# EAGLE schematic untitled (EAGLE 7.2.0)
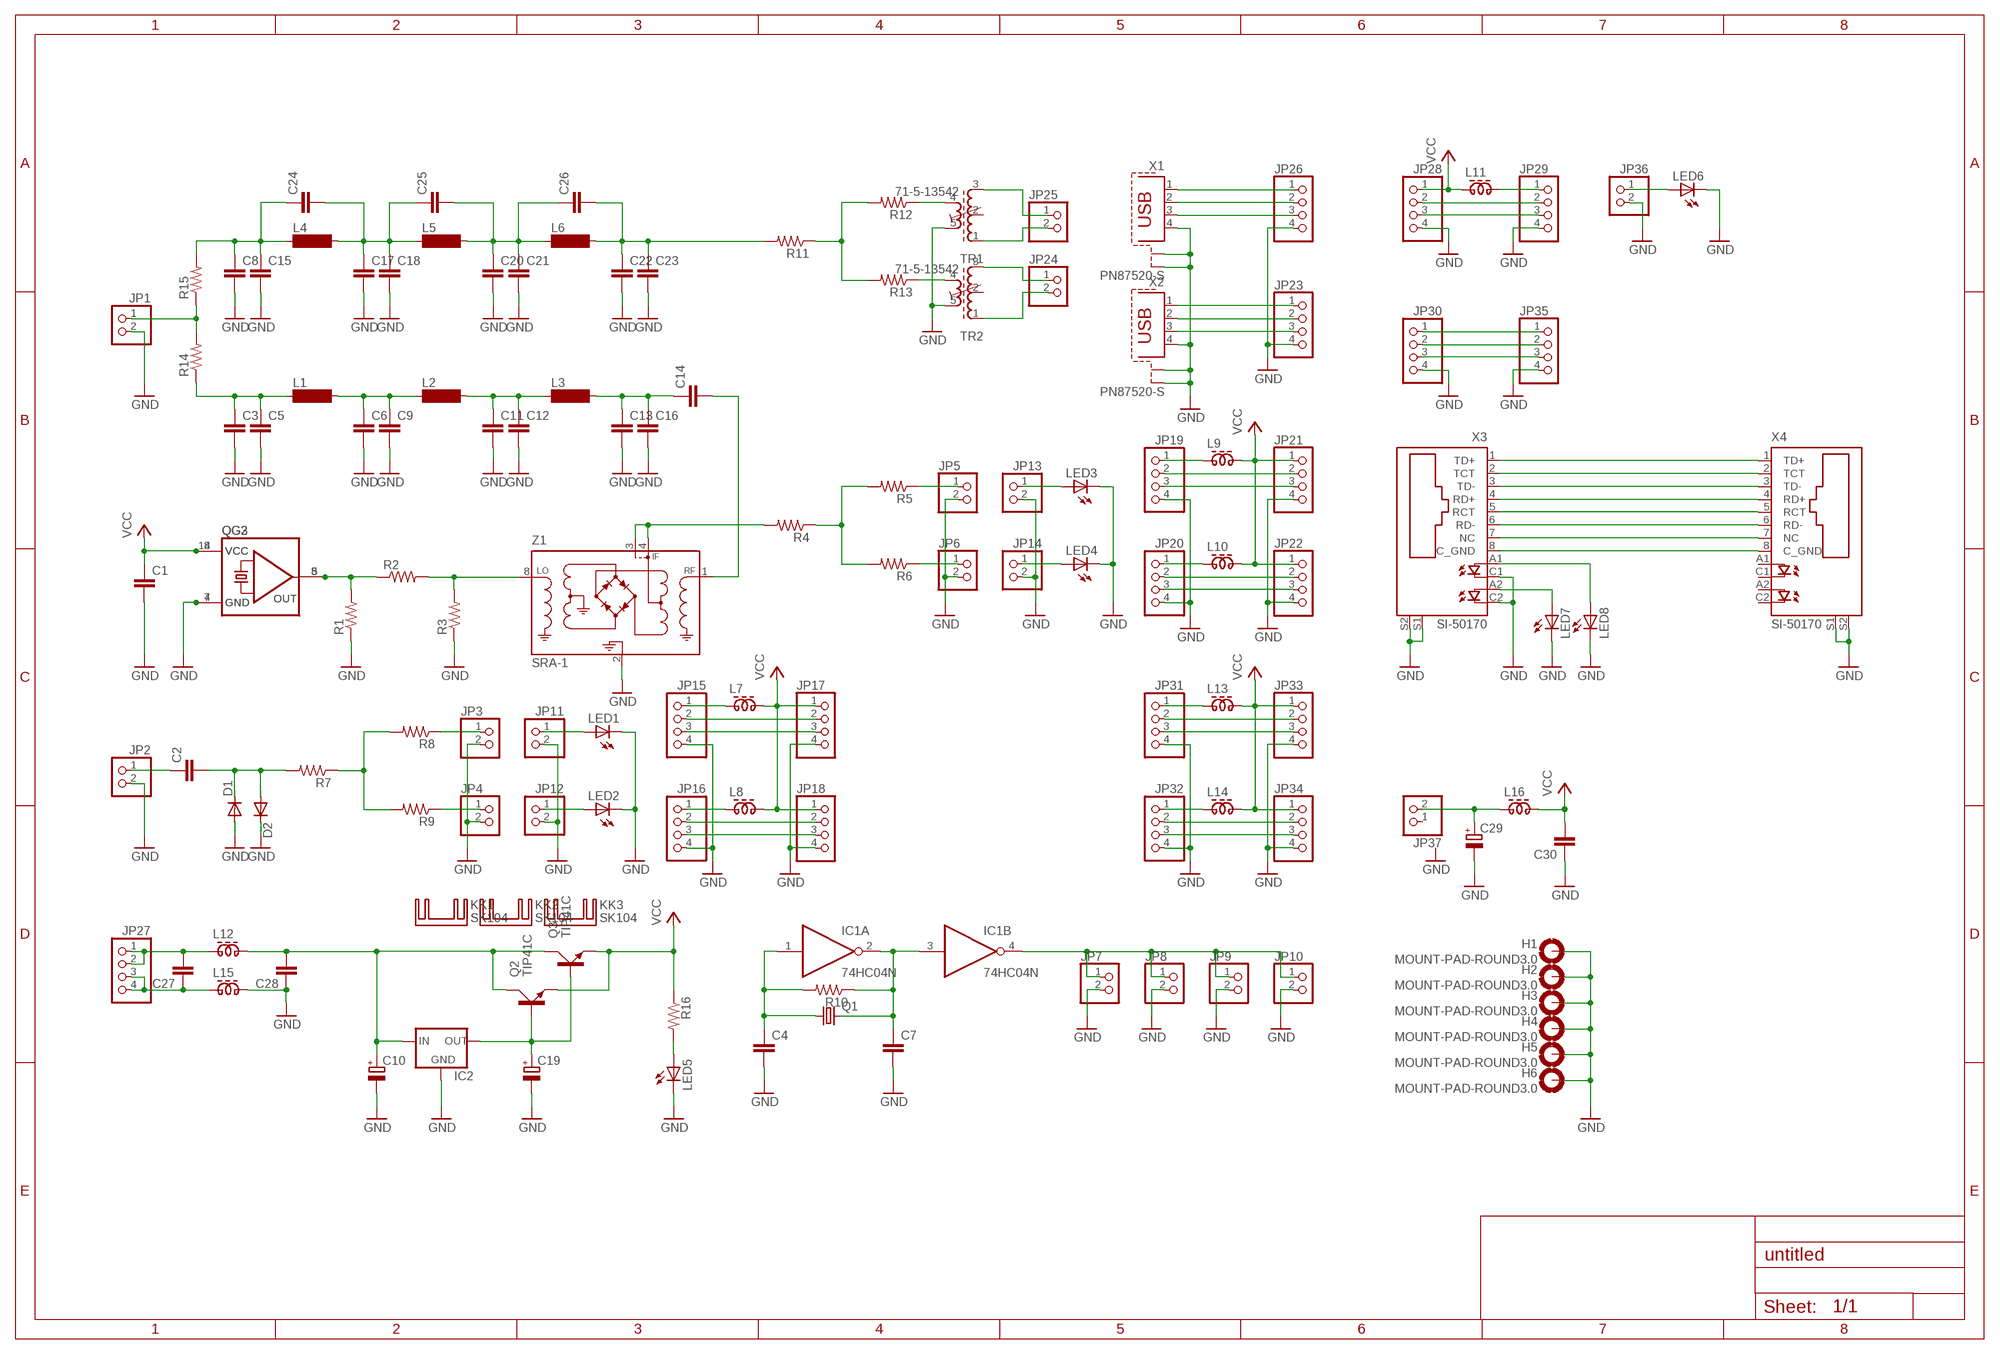
[diagram p0: schematic, sheet 1]

## Parts
C1  C-EUC1206  [C1206]
C2  C-EUC1206  [C1206]
C3  C-EUC1206  [C1206]
C4  C-EUC1206  [C1206]
C5  C-EUC1206  [C1206]
C6  C-EUC1206  [C1206]
C7  C-EUC1206  [C1206]
C8  C-EUC1206  [C1206]
C9  C-EUC1206  [C1206]
C10  CPOL-EUE2.5-7  [E2,5-7]
C11  C-EUC1206  [C1206]
C12  C-EUC1206  [C1206]
C13  C-EUC1206  [C1206]
C14  C-EUC1206  [C1206]
C15  C-EUC1206  [C1206]
C16  C-EUC1206  [C1206]
C17  C-EUC1206  [C1206]
C18  C-EUC1206  [C1206]
C19  CPOL-EUE2.5-7  [E2,5-7]
C20  C-EUC1206  [C1206]
C21  C-EUC1206  [C1206]
C22  C-EUC1206  [C1206]
C23  C-EUC1206  [C1206]
C24  C-EUC1206  [C1206]
C25  C-EUC1206  [C1206]
C26  C-EUC1206  [C1206]
C27  C-EUC1206  [C1206]
C28  C-EUC1206  [C1206]
C29  CPOL-EUE2.5-7  [E2,5-7]
C30  C-EUC1206  [C1206]
D1  DIODE-DO214AC  [DO214AC]
D2  DIODE-DO214AC  [DO214AC]
H1  MOUNT-PAD-ROUND3.0  [3,0-PAD]
H2  MOUNT-PAD-ROUND3.0  [3,0-PAD]
H3  MOUNT-PAD-ROUND3.0  [3,0-PAD]
H4  MOUNT-PAD-ROUND3.0  [3,0-PAD]
H5  MOUNT-PAD-ROUND3.0  [3,0-PAD]
H6  MOUNT-PAD-ROUND3.0  [3,0-PAD]
IC1  74HC04N  [DIL14]
IC2  78XXS  [78XXS]
JP1  PINHD-1X2  [1X02]
JP2  PINHD-1X2  [1X02]
JP3  PINHD-1X2  [1X02]
JP4  PINHD-1X2  [1X02]
JP5  PINHD-1X2  [1X02]
JP6  PINHD-1X2  [1X02]
JP7  PINHD-1X2  [1X02]
JP8  PINHD-1X2  [1X02]
JP9  PINHD-1X2  [1X02]
JP10  PINHD-1X2  [1X02]
JP11  PINHD-1X2  [1X02]
JP12  PINHD-1X2  [1X02]
JP13  PINHD-1X2  [1X02]
JP14  PINHD-1X2  [1X02]
JP15  PINHD-1X4  [1X04]
JP16  PINHD-1X4  [1X04]
JP17  PINHD-1X4  [1X04]
JP18  PINHD-1X4  [1X04]
JP19  PINHD-1X4  [1X04]
JP20  PINHD-1X4  [1X04]
JP21  PINHD-1X4  [1X04]
JP22  PINHD-1X4  [1X04]
JP23  PINHD-1X4  [1X04]
JP24  PINHD-1X2  [1X02]
JP25  PINHD-1X2  [1X02]
JP26  PINHD-1X4  [1X04]
JP27  PINHD-1X4  [1X04]
JP28  PINHD-1X4  [1X04]
JP29  PINHD-1X4  [1X04]
JP30  PINHD-1X4  [1X04]
JP31  PINHD-1X4  [1X04]
JP32  PINHD-1X4  [1X04]
JP33  PINHD-1X4  [1X04]
JP34  PINHD-1X4  [1X04]
JP35  PINHD-1X4  [1X04]
JP36  PINHD-1X2  [1X02]
JP37  PINHD-1X2  [1X02]
KK1  SK104  [SK104]
KK2  SK104  [SK104]
KK3  SK104  [SK104]
L1  BS75  [BS75]
L2  BS75  [BS75]
L3  BS75  [BS75]
L4  BS75  [BS75]
L5  BS75  [BS75]
L6  BS75  [BS75]
L7  ZD60820512  [ZD6-2W5]
L8  ZD60820512  [ZD6-2W5]
L9  ZD60820512  [ZD6-2W5]
L10  ZD60820512  [ZD6-2W5]
L11  ZD60820512  [ZD6-2W5]
L12  ZD60820512  [ZD6-2W5]
L13  ZD60820512  [ZD6-2W5]
L14  ZD60820512  [ZD6-2W5]
L15  ZD60820512  [ZD6-2W5]
L16  ZD60820512  [ZD6-2W5]
LED1  LED3MM  [LED3MM]
LED2  LED3MM  [LED3MM]
LED3  LED3MM  [LED3MM]
LED4  LED3MM  [LED3MM]
LED5  LED3MM  [LED3MM]
LED6  LED3MM  [LED3MM]
LED7  LED3MM  [LED3MM]
LED8  LED3MM  [LED3MM]
Q1  CRYSTALHC49S  [HC49/S]
Q2  TIP41C  [TO220AV]
Q3  TIP41C  [TO220AV]
QG2  QG5460  [DIL08S]
QG3  QG5860  [DIL14S]
R1  R-US_M1206  [M1206]
R2  R-US_M1206  [M1206]
R3  R-US_M1206  [M1206]
R4  R-US_M1206  [M1206]
R5  R-US_M1206  [M1206]
R6  R-US_M1206  [M1206]
R7  R-US_M1206  [M1206]
R8  R-US_M1206  [M1206]
R9  R-US_M1206  [M1206]
R10  R-US_M1206  [M1206]
R11  R-US_M1206  [M1206]
R12  R-US_M1206  [M1206]
R13  R-US_M1206  [M1206]
R14  R-US_M1206  [M1206]
R15  R-US_M1206  [M1206]
R16  R-US_M1206  [M1206]
TR1  71-5-13542  [71-5]
TR2  71-5-13542  [71-5]
X1  PN87520-S  [PN87520-S]
X2  PN87520-S  [PN87520-S]
X3  SI-50170  [SI-50170]
X4  SI-50170  [SI-50170]
Z1  SRA-1  [A01]

## Nets
GND: C1.2 C3.2 C4.2 C5.2 C6.2 C7.2 C8.2 C9.2 C10.- C11.2 C12.2 C13.2 C15.2 C16.2 C17.2 C18.2 C19.- C20.2 C21.2 C22.2 C23.2 C28.1 C29.- C30.1 D1.A D2.C H1.B3,0(MOUNT) H2.B3,0(MOUNT) H3.B3,0(MOUNT) H4.B3,0(MOUNT) H5.B3,0(MOUNT) H6.B3,0(MOUNT) IC2.GND JP1.2 JP2.2 JP3.2 JP4.2 JP5.2 JP6.2 JP7.2 JP8.2 JP9.2 JP10.2 JP11.2 JP12.2 JP13.2 JP14.2 JP15.4 JP16.4 JP17.4 JP18.4 JP19.4 JP20.4 JP21.4 JP22.4 JP23.4 JP26.4 JP28.4 JP29.4 JP30.4 JP31.4 JP32.4 JP33.4 JP34.4 JP35.4 JP36.2 L15.2 LED1.K(C) LED2.K(C) LED3.K(C) LED4.K(C) LED5.K(C) LED6.K(C) LED7.K(C) LED8.K(C) QG2.4(GND) QG3.7(GND) R1.1 R3.1 TR1.5(A2) TR2.5(A2) X1.4 X1.S1 X1.S2 X2.4 X2.S1 X2.S2 X3.C1(C) X3.C2(C1) X3.S1 X3.S2 X4.S1 X4.S2 Z1.2(CASEGROUND)
N$1: C3.1 C5.1 L1.1 R14.1
N$2: C6.1 C9.1 L1.2 L2.1
N$3: JP1.1 R14.2 R15.1
N$4: C11.1 C12.1 L2.2 L3.1
N$5: C13.1 C14.1 C16.1 L3.2
N$6: QG2.5(OUT) QG3.8(OUT) R1.2 R2.1
N$7: R2.2 R3.2 Z1.8(L)
N$8: R4.2 Z1.3(IF) Z1.4(IF)
N$9: C14.2 Z1.1(R)
N$10: R4.1 R5.2 R6.2
N$11: C4.1 IC1.1(A:I) Q1.1 R10.2
N$12: C2.1 JP2.1
N$13: C2.2 D1.C D2.A R7.2
N$14: R7.1 R8.2 R9.2
N$15: JP3.1 R8.1
N$16: JP4.1 R9.1
N$17: JP5.1 R5.1
N$18: JP6.1 R6.1
N$19: C7.1 IC1.2(A:O) IC1.3(B:I) Q1.2 R10.1
N$20: IC1.4(B:O) JP7.1 JP8.1 JP9.1 JP10.1
N$21: JP11.1 LED1.A
N$22: JP12.1 LED2.A
N$23: JP13.1 LED3.A
N$24: JP14.1 LED4.A
N$25: JP15.2 JP17.2
N$26: JP15.3 JP17.3
N$27: JP16.2 JP18.2
N$28: JP16.3 JP18.3
N$29: JP15.1 L7.1
N$30: JP16.1 L8.1
N$31: JP19.2 JP21.2
N$32: JP19.3 JP21.3
N$33: C8.1 C15.1 C24.1 L4.1 R15.2
N$34: C17.1 C18.1 C24.2 C25.1 L4.2 L5.1
N$35: JP20.2 JP22.2
N$36: C20.1 C21.1 C25.2 C26.1 L5.2 L6.1
N$37: C22.1 C23.1 C26.2 L6.2 R11.2
N$38: R13.1 TR2.4(E2)
N$39: R11.1 R12.2 R13.2
N$40: R12.1 TR1.4(E2)
N$41: JP25.2 TR1.1(A1)
N$42: JP24.1 TR2.3(E1)
N$43: JP24.2 TR2.1(A1)
N$44: JP25.1 TR1.3(E1)
N$45: JP20.3 JP22.3
N$46: JP19.1 L9.1
N$47: JP20.1 L10.1
N$48: JP26.1 X1.1
N$49: JP26.2 X1.2
N$50: JP26.3 X1.3
N$51: JP23.1 X2.1
N$52: JP23.2 X2.2
N$53: JP23.3 X2.3
N$54: C10.+ C28.2 IC2.IN L12.2 Q2.C Q3.C
N$55: C19.+ IC2.OUT Q2.B Q3.B
N$56: JP28.2 JP29.2
N$57: JP28.3 JP29.3
N$58: LED5.A R16.2
N$59: JP30.2 JP35.2
N$60: JP31.2 JP33.2
N$61: JP31.3 JP33.3
N$62: JP32.2 JP34.2
N$63: JP32.3 JP34.3
N$64: JP31.1 L13.1
N$65: JP32.1 L14.1
N$66: JP29.1 L11.2
N$67: JP30.3 JP35.3
N$68: JP30.1 JP35.1
N$69: JP36.1 LED6.A
N$70: X3.1(TD+) X4.1(TD+)
N$71: X3.2(TCT) X4.2(TCT)
N$72: X3.3(TD-) X4.3(TD-)
N$73: X3.4(RD+) X4.4(RD+)
N$74: X3.5(RCT) X4.5(RCT)
N$75: X3.6(RD-) X4.6(RD-)
N$76: X3.7(NC) X4.7(NC)
N$77: X3.8(C_GND) X4.8(C_GND)
N$78: LED7.A X3.A2(A1)
N$79: LED8.A X3.A1(A)
N$80: C27.2 JP27.1 JP27.2 L12.1
N$81: C27.1 JP27.3 JP27.4 L15.1
N$84: C29.+ JP37.2 L16.1
VCC: C1.1 C30.2 JP17.1 JP18.1 JP21.1 JP22.1 JP28.1 JP33.1 JP34.1 L7.2 L8.2 L9.2 L10.2 L11.1 L13.2 L14.2 L16.2 Q2.E Q3.E QG2.8(VCC) QG3.14(VCC) R16.1
Unconnected: IC1.5(C:I) IC1.6(C:O) IC1.8(D:O) IC1.9(D:I) IC1.10(E:O) IC1.11(E:I) IC1.12(F:O) IC1.13(F:I) JP37.1 TR1.2(Z) TR1.S1 TR1.S2 TR2.2(Z) TR2.S1 TR2.S2 X4.A1(A) X4.A2(A1) X4.C1(C) X4.C2(C1)

## Power pins joined to a net without a drawn wire
GND: IC1.7(P:GND) Z1.5(GND) Z1.6(GND) Z1.7(GND)
VCC: IC1.14(P:VCC)

## Library data of the parts
C1-C9 C11-C18 C20-C28 C30 = resistor:C-EU: CAPACITOR, European symbol
C10 C19 C29 = resistor:CPOL-EU: POLARIZED CAPACITOR, European symbol
D1 D2 = diode:DIODE-: DIODE
H1-H6 = holes:MOUNT-PAD-ROUND: MOUNTING PAD, round
IC1 = 74xx-eu:74*04: Hex INVERTER
IC2 = v-reg:78XXS: VOLTAGE REGULATOR
JP1-JP14 JP24 JP25 JP36 JP37 = pinhead:PINHD-1X2: PIN HEADER
JP15-JP23 JP26-JP35 = pinhead:PINHD-1X4: PIN HEADER
KK1-KK3 = heatsink:SK104: HEATSINK manufacturer Fischer/distributor Buerklin
L1-L6 = inductor-neosid:BS: INDUCTOR nominal inductance, magnetically screened; OC_FARNELL: unknown; OC_NEWARK: unknown
L7-L16 = inductor-neosid:ZD60820512: WIDE-BAND CHOKE 2.5 windings; OC_FARNELL: unknown; OC_NEWARK: unknown
LED1-LED8 = led:LED: LED OSRAM: - CHIPLED LG R971, LG N971, LY N971, LG Q971, LY Q971, LO R971, LY R971 LH N974, LH R974 LS Q976, LO Q976, LY Q976 LO Q996 - Hyper CHIPLED LW Q18S LB Q993, LB Q99A, LB R99A - SideLED LS A670, LO A670, LY A670, LG A670, LP A670 LB A673, LV A673, LT A673, LW A673 LH A674 LY A675 LS A676, LA A676, LO A676, LY A676, LW A676 LS A679, LY A679, LG A679 - Hyper Micro SIDELED® LS Y876, LA Y876, LO Y876, LY Y876 LT Y87S - SmartLED LW L88C, LW L88S LB L89C, LB L89S, LG L890 LS L89K, LO L89K, LY L89K LS L896, LA L896, LO L896, LY L896 - TOPLED LS T670, LO T670, LY T670, LG T670, LP T670 LSG T670, LSP T670, LSY T670, LOP T670, LYG T670 LG T671, LOG T671, LSG T671 LB T673, LV T673, LT T673, LW T673 LH T674 LS T676, LA T676, LO T676, LY T676, LB T676, LH T676, LSB T676, LW T676 LB T67C, LV T67C, LT T67C, LS T67K, LO T67K, LY T67K, LW E67C LS E67B, LA E67B, LO E67B, LY E67B, LB E67C, LV E67C, LT E67C LW T67C LS T679, LY T679, LG T679 LS T770, LO T770, LY T770, LG T770, LP T770 LB T773, LV T773, LT T773, LW T773 LH T774 LS E675, LA E675, LY E675, LS T675 LS T776, LA T776, LO T776, LY T776, LB T776 LHGB T686 LT T68C, LB T68C - Hyper Mini TOPLED® LB M676 - Mini TOPLED Santana® LG M470 LS M47K, LO M47K, LY M47K Source: http://www.osram.convergy.de LUXEON: - LUMILED® LXK2-PW12-R00, LXK2-PW12-S00, LXK2-PW14-U00, LXK2-PW14-V00 LXK2-PM12-R00, LXK2-PM12-S00, LXK2-PM14-U00 LXK2-PE12-Q00, LXK2-PE12-R00, LXK2-PE12-S00, LXK2-PE14-T00, LXK2-PE14-U00 LXK2-PB12-K00, LXK2-PB12-L00, LXK2-PB12-M00, LXK2-PB14-N00, LXK2-PB14-P00, LXK2-PB14-Q00 LXK2-PR12-L00, LXK2-PR12-M00, LXK2-PR14-Q00, LXK2-PR14-R00 LXK2-PD12-Q00, LXK2-PD12-R00, LXK2-PD12-S00 LXK2-PH12-R00, LXK2-PH12-S00 LXK2-PL12-P00, LXK2-PL12-Q00, LXK2-PL12-R00 Source: www.luxeon.com KINGBRIGHT: KA-3528ASYC Source: www.kingbright.com
Q1 = crystal:CRYSTAL: CRYSTAL; OC_FARNELL: 1667008; OC_NEWARK: unknown
Q2 Q3 = transistor-power:TIP41C: NPN TRANSISTOR
QG2 = crystal:QG5460: CRYSTAL RESONATOR; OC_FARNELL: unknown; OC_NEWARK: unknown
QG3 = crystal:QG5860: CRYSTAL RESONATOR; OC_FARNELL: unknown; OC_NEWARK: unknown
R1-R16 = resistor:R-US_: RESISTOR, American symbol
TR1 TR2 = inductor-neosid:71-5-: TRANSFORMER adjustable filter transformer with tap; OC_FARNELL: unknown; OC_NEWARK: unknown
X1 X2 = con-berg:PN87520-S; OC_FARNELL: unknown; OC_NEWARK: unknown
X3 X4 = con-stewart:SI-50170: Ethernet Connector MagJack (R) Source: www.stewartconnector.com .. si-50170.pdf; OC_FARNELL: unknown; OC_NEWARK: unknown
Z1 = minicircuits:SRA-1: Frequency Mixer Level 7 (LO Power + 7 dBm) Source: minicircuits.com .. SRA-1+.pdf; OC_FARNELL: unknown; OC_NEWARK: unknown